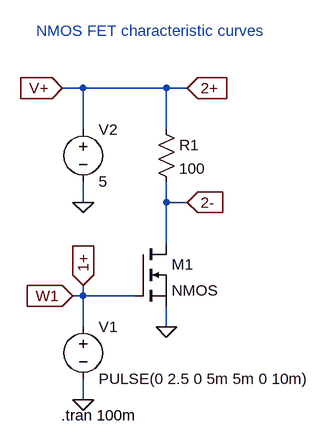
[diagram p0: schematic nmos_curve.asc]
nmos_curve.asc, the LTspice schematic file:
Version 4
SHEET 1 880 680
WIRE 64 -144 32 -144
WIRE 192 -144 64 -144
WIRE 224 -144 192 -144
WIRE 64 -80 64 -144
WIRE 192 -80 192 -144
WIRE 64 32 64 0
WIRE 192 32 192 0
WIRE 224 32 192 32
WIRE 192 96 192 32
WIRE 64 176 64 160
WIRE 64 176 48 176
WIRE 144 176 64 176
WIRE 64 224 64 176
WIRE 192 224 192 192
WIRE 64 336 64 304
FLAG 192 224 0
FLAG 64 336 0
FLAG 64 32 0
FLAG 48 176 W1
IOPIN 48 176 In
FLAG 64 160 1+
IOPIN 64 160 In
FLAG 224 -144 2+
IOPIN 224 -144 In
FLAG 224 32 2-
IOPIN 224 32 In
FLAG 32 -144 V+
IOPIN 32 -144 In
SYMBOL nmos 144 96 R0
SYMATTR InstName M1
SYMBOL res 176 -96 R0
SYMATTR InstName R1
SYMATTR Value 100
SYMBOL voltage 64 208 R0
WINDOW 123 0 0 Left 0
WINDOW 39 0 0 Left 0
SYMATTR InstName V1
SYMATTR Value PULSE(0 2.5 0 5m 5m 0 10m)
SYMBOL voltage 64 -96 R0
WINDOW 123 0 0 Left 0
WINDOW 39 0 0 Left 0
SYMATTR InstName V2
SYMATTR Value 5
TEXT 30 360 Left 2 !.tran 100m
TEXT -8 -232 Left 2 ;NMOS FET characteristic curves

The netlist it stands for:
* nmos_curve.asc
M1 2- 1+ 0 0 NMOS
R1 V+ 2- 100
V1 1+ 0 PULSE(0 2.5 0 5m 5m 0 10m)
V2 V+ 0 5
.model NMOS NMOS
.model PMOS PMOS
.lib standard.mos
.tran 100m
* NMOS FET characteristic curves
.backanno
.end